# Altium schematic sheet Edge_logic_analyzer.SchDoc
size A4; DocumentNumber: 6; SheetNumber: 6; SheetTotal: 6
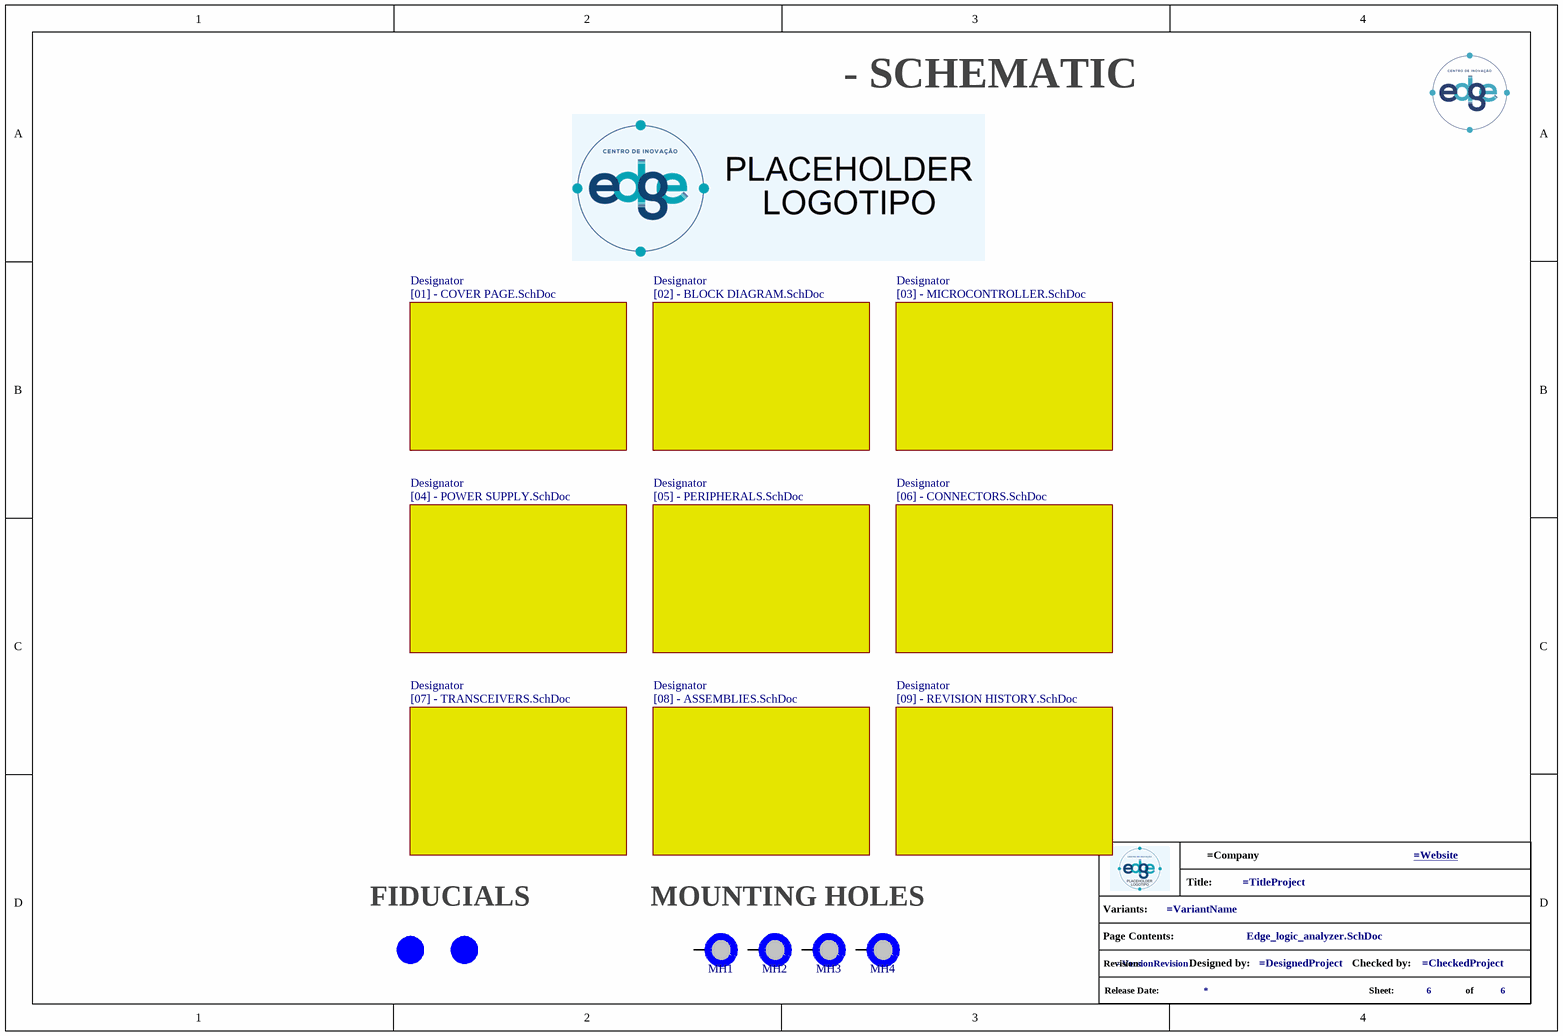
[diagram p0: Edge_logic_analyzer.SchDoc]

## Parts
*?  info_project  (value not drawn)  (graphical)
FID1  FID_40X1.20  [FID_40X1.20]  (value not drawn)  (no BOM)
FID2  FID_40X1.20  [FID_40X1.20]  (value not drawn)  (no BOM)
MH1  MH_7.4MMC_3.2MMD  [MH_7.4MMC_3.2MMD]  (value not drawn)  (no BOM)
MH2  MH_7.4MMC_3.2MMD  [MH_7.4MMC_3.2MMD]  (value not drawn)  (no BOM)
MH3  MH_7.4MMC_3.2MMD  [MH_7.4MMC_3.2MMD]  (value not drawn)  (no BOM)
MH4  MH_7.4MMC_3.2MMD  [MH_7.4MMC_3.2MMD]  (value not drawn)  (no BOM)

## Sub-sheets
Designator = [02] - BLOCK DIAGRAM.SchDoc: no entries
Designator = [03] - MICROCONTROLLER.SchDoc: no entries
Designator = [01] - COVER PAGE.SchDoc: no entries
Designator = [04] - POWER SUPPLY.SchDoc: no entries
Designator = [06] - CONNECTORS.SchDoc: no entries
Designator = [05] - PERIPHERALS.SchDoc: no entries
Designator = [07] - TRANSCEIVERS.SchDoc: no entries
Designator = [09] - REVISION HISTORY.SchDoc: no entries
Designator = [08] - ASSEMBLIES.SchDoc: no entries

## Nets

Not connected (* = marked no-connect by the designer): MH1 1; MH2 1; MH3 1; MH4 1

## Notes on the sheet
- - SCHEMATIC
- FIDUCIALS
- MOUNTING HOLES
- (in symbol info_project) Title:; Variants:; Page Contents:; Revision:; Designed by:; Checked by:; Release Date:; Sheet:; of

## Library data of the parts
FID1 FID2 = FID_40X1.20: Fiducials
MH1-MH4 = MH_7.4MMC_3.2MMD: Mounting Hole 7.4mm Diameter 3.2mm Drill